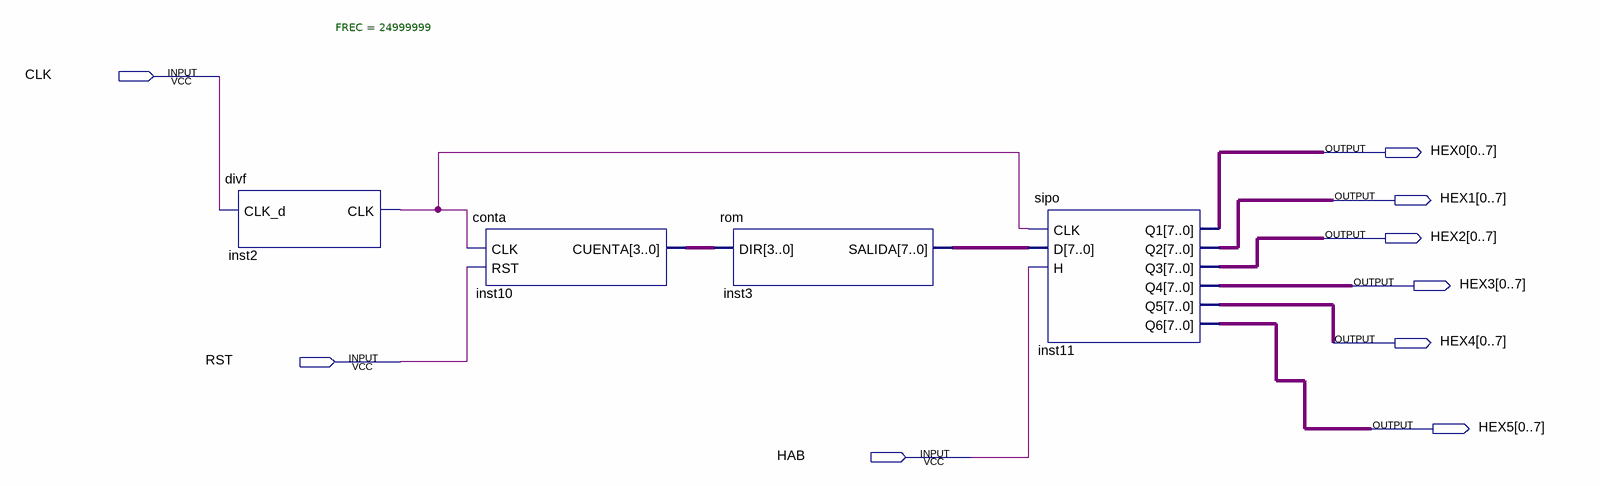
[diagram p0: schematic sheet]
// Quartus schematic FraseMemoria.bdf as structural Verilog: 4 symbols, 9 pins
module FraseMemoria (
  input  CLK,
  input  RST,
  input  HAB,
  output [0:7] HEX0,
  output [0:7] HEX1,
  output [0:7] HEX2,
  output [0:7] HEX3,
  output [0:7] HEX4,
  output [0:7] HEX5
);

  wire inst2_clk;
  wire [3:0] inst10_cuenta;
  wire [7:0] inst3_salida;

  divf #(.FREC(24999999)) inst2 (.CLK_d(CLK), .CLK(inst2_clk));
  conta inst10 (.CLK(inst2_clk), .RST(RST), .CUENTA(inst10_cuenta));
  rom inst3 (.DIR(inst10_cuenta), .SALIDA(inst3_salida));
  sipo inst11 (
    .CLK(inst2_clk), .D(inst3_salida), .H(HAB), .Q1(HEX0), .Q2(HEX1), .Q3(HEX2), .Q4(HEX3), .Q5(HEX4),
    .Q6(HEX5));
endmodule
